# Altium schematic sheet 3_bootleg-alps-mcu.SchDoc: =ProjectTitle
size A4; Address1: github.com/4pplet/bootlegs; Address2: Licence: CERN-OHL-S; Address4: www.4pplet.com; SheetNumber: 3; SheetTotal: 4
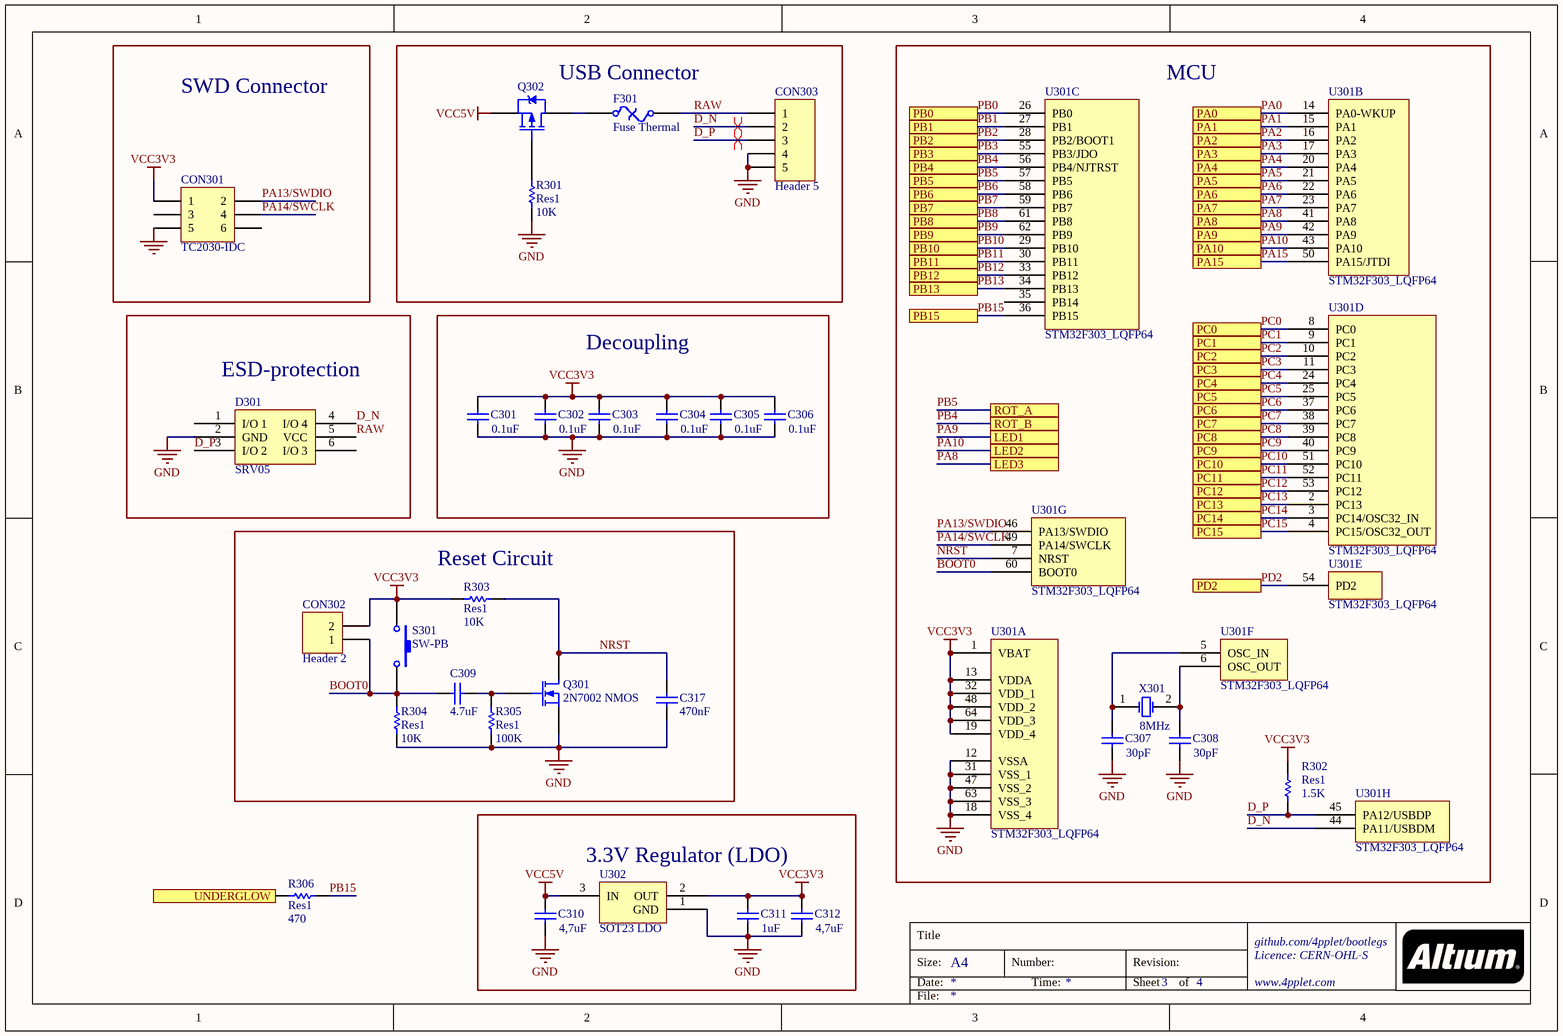
[diagram p0: 3_bootleg-alps-mcu.SchDoc]

## Parts
C301  value 0.1uF  [C0603[1608]]
C302  value 0.1uF  [C0603[1608]]
C303  value 0.1uF  [C0603[1608]]
C304  value 0.1uF  [C0603[1608]]
C305  value 0.1uF  [C0603[1608]]
C306  value 0.1uF  [C0603[1608]]
C307  value 30pF  [C0603[1608]]
C308  value 30pF  [C0603[1608]]
C309  value 4.7uF  [C0603[1608]]
C310  value 4,7uF  [C0603[1608]]
C311  value 1uF  [C0603[1608]]
C312  value 4,7uF  [C0603[1608]]
C317  value 470nF  [C0603[1608]]
CON301  TC2030-IDC  [TC2030-IDC-NL]  (no BOM)
CON302  Header 2  [HDR1X2]  (no BOM)
CON303  Header 5  [JST SM04B-SRSS-TB]
D301  SRV05  [SOT-23-6]
F301  Fuse Thermal  [C1206[3216]]
Q301  2N7002 NMOS  [SOT-23-3]
Q302  PMOS-2  [SOT-23-3]  (value not drawn)
R301  Res1  value 10K  [R0603[1608]]
R302  Res1  value 1.5K  [R0603[1608]]
R303  Res1  value 10K  [R0603[1608]]
R304  Res1  value 10K  [R0603[1608]]
R305  Res1  value 100K  [R0603[1608]]
R306  Res1  value 470  [R0603[1608]]
S301  SW-PB  [XKB Switch]
U301  STM32F303_LQFP64  [STM32 - LQFP64, 10x10mm]  (parts A,B,C,D,E,F,G,H of 8)
U302  SOT23 LDO  [SOT-23-3]
X301  value 8MHz  [CTS 445-series crystal]  (hidden comment: XTAL)

## Blocks framed on the sheet
SWD Connector: CON301
USB Connector: CON303 F301 Q302 R301
MCU: C307 C308 R302 U301 X301
ESD-protection: D301
Decoupling: C301-C306
Reset Circuit: C309 C317 CON302 Q301 R303-R305 S301
3.3V Regulator (LDO): C310-C312 U302

## Ports
LED1, LED2, LED3, PA0, PA1, PA2, PA3, PA4, PA5, PA6, PA7, PA8, PA9, PA10, PA15, PB0, PB1, PB2, PB3, PB4, PB5, PB6, PB7, PB8, PB9, PB10, PB11, PB12, PB13, PB15, PC0, PC1, PC2, PC3, PC4, PC5, PC6, PC7, PC8, PC9, PC10, PC11, PC12, PC13, PC14, PC15, PD2, ROT_A, ROT_B, UNDERGLOW

## Nets
GND: C301.1 C302.1 C303.1 C304.1 C305.1 C306.1 C307.1 C308.1 C310.1 C311.1 C312.1 C317.2 CON301.5 CON303.4 CON303.5 D301.2(GND) Q301.2(S) R301.2 R304.2 R305.2 U301.12(VSSA) U301.18(VSS_4) U301.31(VSS_1) U301.47(VSS_2) U301.63(VSS_3) U302.1(GND)
VCC3V3: C301.2 C302.2 C303.2 C304.2 C305.2 C306.2 C311.2 C312.2 CON301.1 CON302.2 R302.1 R303.1 S301.1 U301.1(VBAT) U301.13(VDDA) U301.19(VDD_4) U301.32(VDD_1) U301.48(VDD_2) U301.64(VDD_3) U302.2(OUT)
VCC5V: C310.2 Q302.2(S) U302.3(IN)
BOOT0: C309.1 CON302.1 R304.1 S301.2 U301.60(BOOT0)
D_N: CON303.2 D301.4(I/O_4) U301.44(PA11/USBDM)
D_P: CON303.3 D301.3(I/O_2) R302.2 U301.45(PA12/USBDP)
NRST: C317.1 Q301.3(D) R303.2 U301.7(NRST)
PA0: U301.14(PA0-WKUP) ; port PA0
PA1: U301.15(PA1) ; port PA1
PA2: U301.16(PA2) ; port PA2
PA3: U301.17(PA3) ; port PA3
PA4: U301.20(PA4) ; port PA4
PA5: U301.21(PA5) ; port PA5
PA6: U301.22(PA6) ; port PA6
PA7: U301.23(PA7) ; port PA7
PA8: U301.41(PA8) ; port LED3, port PA8
PA9: U301.42(PA9) ; port LED1, port PA9
PA10: U301.43(PA10) ; port LED2, port PA10
PA13/SWDIO: CON301.2 U301.46(PA13/SWDIO)
PA14/SWCLK: CON301.4 U301.49(PA14/SWCLK)
PA15: U301.50(PA15/JTDI) ; port PA15
PB0: U301.26(PB0) ; port PB0
PB1: U301.27(PB1) ; port PB1
PB2: U301.28(PB2/BOOT1) ; port PB2
PB3: U301.55(PB3/JDO) ; port PB3
PB4: U301.56(PB4/NJTRST) ; port ROT_B, port PB4
PB5: U301.57(PB5) ; port ROT_A, port PB5
PB6: U301.58(PB6) ; port PB6
PB7: U301.59(PB7) ; port PB7
PB8: U301.61(PB8) ; port PB8
PB9: U301.62(PB9) ; port PB9
PB10: U301.29(PB10) ; port PB10
PB11: U301.30(PB11) ; port PB11
PB12: U301.33(PB12) ; port PB12
PB13: U301.34(PB13) ; port PB13
PB15: R306.2 U301.36(PB15) ; port PB15
PC0: U301.8(PC0) ; port PC0
PC1: U301.9(PC1) ; port PC1
PC2: U301.10(PC2) ; port PC2
PC3: U301.11(PC3) ; port PC3
PC4: U301.24(PC4) ; port PC4
PC5: U301.25(PC5) ; port PC5
PC6: U301.37(PC6) ; port PC6
PC7: U301.38(PC7) ; port PC7
PC8: U301.39(PC8) ; port PC8
PC9: U301.40(PC9) ; port PC9
PC10: U301.51(PC10) ; port PC10
PC11: U301.52(PC11) ; port PC11
PC12: U301.53(PC12) ; port PC12
PC13: U301.2(PC13) ; port PC13
PC14: U301.3(PC14/OSC32_IN) ; port PC14
PC15: U301.4(PC15/OSC32_OUT) ; port PC15
PD2: U301.54(PD2) ; port PD2
RAW: CON303.1 D301.5(VCC) F301.2
UNDERGLOW: R306.1 ; port UNDERGLOW
NetC307_2: C307.2 U301.5(OSC_IN) X301.1(OSC1)
NetC308_2: C308.2 U301.6(OSC_OUT) X301.2(OSC2)
NetC309_2: C309.2 Q301.1(G) R305.1
NetF301_1: F301.1 Q302.3(D)
NetQ302_1: Q302.1(G) R301.1

Not connected (* = marked no-connect by the designer): CON301 3 6; D301 1(I/O_1) 6(I/O_3); U301 35(PB14)

## Layout directives
differential pair: D_N, D_P

## Notes on the sheet
- Title
- Size:
- Date:
- A4
- Number:
- Time:
- Revision:
- Sheet
- of
- File:

## Library data of the parts
C301-C306 C317 = Cap: Capacitor; MRF.Part: CC0603KRX7R9BB104; MFG: KEMET; MFGPN: C0603C104M5RACTU; LCSC MFG: YAGEO; Version: 0603 imperial; LCSC Part #: C14663
C307 C308 = Cap: Capacitor; MRF.Part: CL10C300JB8NNNC; LCSC MFG: Samsung Electro-Mechanics; Version: 0603 imperial; LCSC Part #: C22397
C309 C310 C312 = Cap: Capacitor; LCSC MFG: Samsung Electro-Mechanics; LCSC Part #: C19666
  C309: Version: 0603 imperial
C311 = Cap: Capacitor; MRF.Part: CL10A105KB8NNNC; MFG: KEMET; MFGPN: C0603C104M5RACTU; LCSC MFG: Samsung Electro-Mechanics; Version: 0603 imperial; LCSC Part #: C15849
CON301 = Header 3X2: Header, 3-Pin, Dual row
CON302 = Header 2: Header, 2-Pin
CON303 = Header 5: JST for USB daughter board; MFGPN: SM04B-SRSS-TB(LF)(SN); MFG: JST Sales America Inc.; LCSC MFG: JST Sales America; LCSC Part #: C160404; MRF.Part: SM04B-SRSS-TB(LF)(SN)
D301 = SRV05: MRF.Part: SRV05-4-P-T7; LCSC MFG: ProTek Devices; LCSC Part #: C85364
F301 = Fuse Thermal: Thermal Fuse; MRF.Part: ASMD1206-050; MFG: Bel Fuse Inc.; MFGPN: 0ZCJ0050FF2G; LCSC MFG: Shenzhen JDT Fuse; LCSC Part #: C135338
Q301 = MOSFET-N: N-Channel MOSFET; LCSC MFG: Changjiang Electronics Tech (CJ); LCSC Part #: C8545; MRF.Part: 2N7002
Q302 = PMOS-2: P-Channel Power MOSFET; MRF.Part: SI2301CDS-T1-GE3; LCSC MFG: Vishay Intertech; LCSC Part #: C10487; Version: SOT23-3
R301 R303 R304 = Res1: Resistor; MRF.Part: 0603WAF1002T5E; MFG: Panasonic Electronic Components; MFGPN: ERJ-3EKF5101V; LCSC MFG: Uniroyal Elec; Version: 0603 imperial; LCSC Part #: C25804
R302 = Res1: Resistor; MRF.Part: 0603WAF1501T5E; LCSC MFG: Uniroyal Elec; Version: 0603 imperial; LCSC Part #: C22843
R305 = Res1: Resistor; MRF.Part: 0603WAF1003T5E; LCSC MFG: Uniroyal Elec; Version: 0603 imperial; LCSC Part #: C25803
R306 = Res1: Resistor; MRF.Part: 0603WAF4700T5E; MFG: Panasonic Electronic Components; MFGPN: ERJ-3EKF5101V; LCSC MFG: UNI-ROYAL(Uniroyal Elec); Version: 0603 imperial; LCSC Part #: C23179
S301 = SW-PB: Switch; MRF.Part: TS-1187A-C-D-B; MFGPN: PTS645SM43SMTR92 LFS; MFG: C&K; LCSC MFG: XKB Enterprise; LCSC Part #: C318888
U301 = STM32F303_LQFP64: MRF.Part: STM32F303RET6; LCSC MFG: STMicroelectronics; LCSC Part #: C183214; Version: LQFP-64
U302 = SOT23 LDO: MRF.Part: XC6206P332MR; LCSC MFG: Torex Semicon; MFG: Texas Instruments; MFGPN: TPS7A0533PDBZ; LCSC Part #: C5446
X301 = XTAL: Crystal Oscillator; MRF.Part: X50328MSB2GI; LCSC MFG: Yangxing Tech; Version: SMD-5032_2P; LCSC Part #: C115962